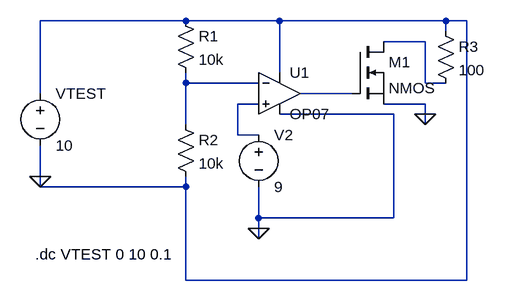
[diagram p0: schematic circuit-schematic.asc]
circuit-schematic.asc, the LTspice schematic file:
Version 4
SHEET 1 1268 912
WIRE 800 304 576 304
WIRE 944 304 800 304
WIRE 1200 304 944 304
WIRE 1232 304 1200 304
WIRE 1200 320 1200 304
WIRE 1168 336 1104 336
WIRE 944 384 944 304
WIRE 800 400 800 384
WIRE 912 400 800 400
WIRE 1168 400 1168 336
WIRE 1200 400 1168 400
WIRE 576 416 576 304
WIRE 1056 416 976 416
WIRE 912 432 880 432
WIRE 1168 432 1104 432
WIRE 1120 448 944 448
WIRE 1168 448 1168 432
WIRE 800 464 800 400
WIRE 1168 464 1168 448
WIRE 880 480 880 432
WIRE 912 480 880 480
WIRE 576 544 576 496
WIRE 576 560 576 544
WIRE 800 560 800 544
WIRE 800 560 576 560
WIRE 912 608 912 560
WIRE 1120 608 1120 448
WIRE 1120 608 912 608
WIRE 912 624 912 608
WIRE 912 640 912 624
WIRE 800 704 800 560
WIRE 1232 704 1232 304
WIRE 1232 704 800 704
FLAG 912 624 0
FLAG 1168 448 0
FLAG 576 544 0
SYMBOL res 784 288 R0
SYMATTR InstName R1
SYMATTR Value 10k
SYMBOL res 784 448 R0
SYMATTR InstName R2
SYMATTR Value 10k
SYMBOL OpAmps/OP07 944 352 R0
SYMATTR InstName U1
SYMBOL voltage 912 464 R0
SYMATTR InstName V2
SYMATTR Value 9
SYMBOL nmos 1056 336 R0
SYMATTR InstName M1
SYMBOL res 1184 304 R0
SYMATTR InstName R3
SYMATTR Value 100
SYMBOL voltage 576 400 R0
SYMATTR InstName VTEST
SYMATTR Value 10
TEXT 568 664 Left 2 !.dc VTEST 0 10 0.1

The netlist it stands for:
* circuit-schematic.asc
R1 0 N002 10k
R2 N002 0 10k
XU1 N004 N002 0 0 N003 LT1001  ; OP07, pins In+ In- V+ V- OUT
V2 N004 0 9
M1 N001 N003 0 0 NMOS
R3 0 N001 100
VTEST 0 0 10
.model NMOS NMOS
.model PMOS PMOS
.lib standard.mos
.dc VTEST 0 10 0.1
.lib LTC.lib
.backanno
.end